# Altium schematic sheet Overview.SchDoc: Overview
size Letter; Date: 2017-02-04; DocumentNumber: 1; Revision: A; SheetNumber: 1; SheetTotal: 16; DesignedBy: Craig Comberbach
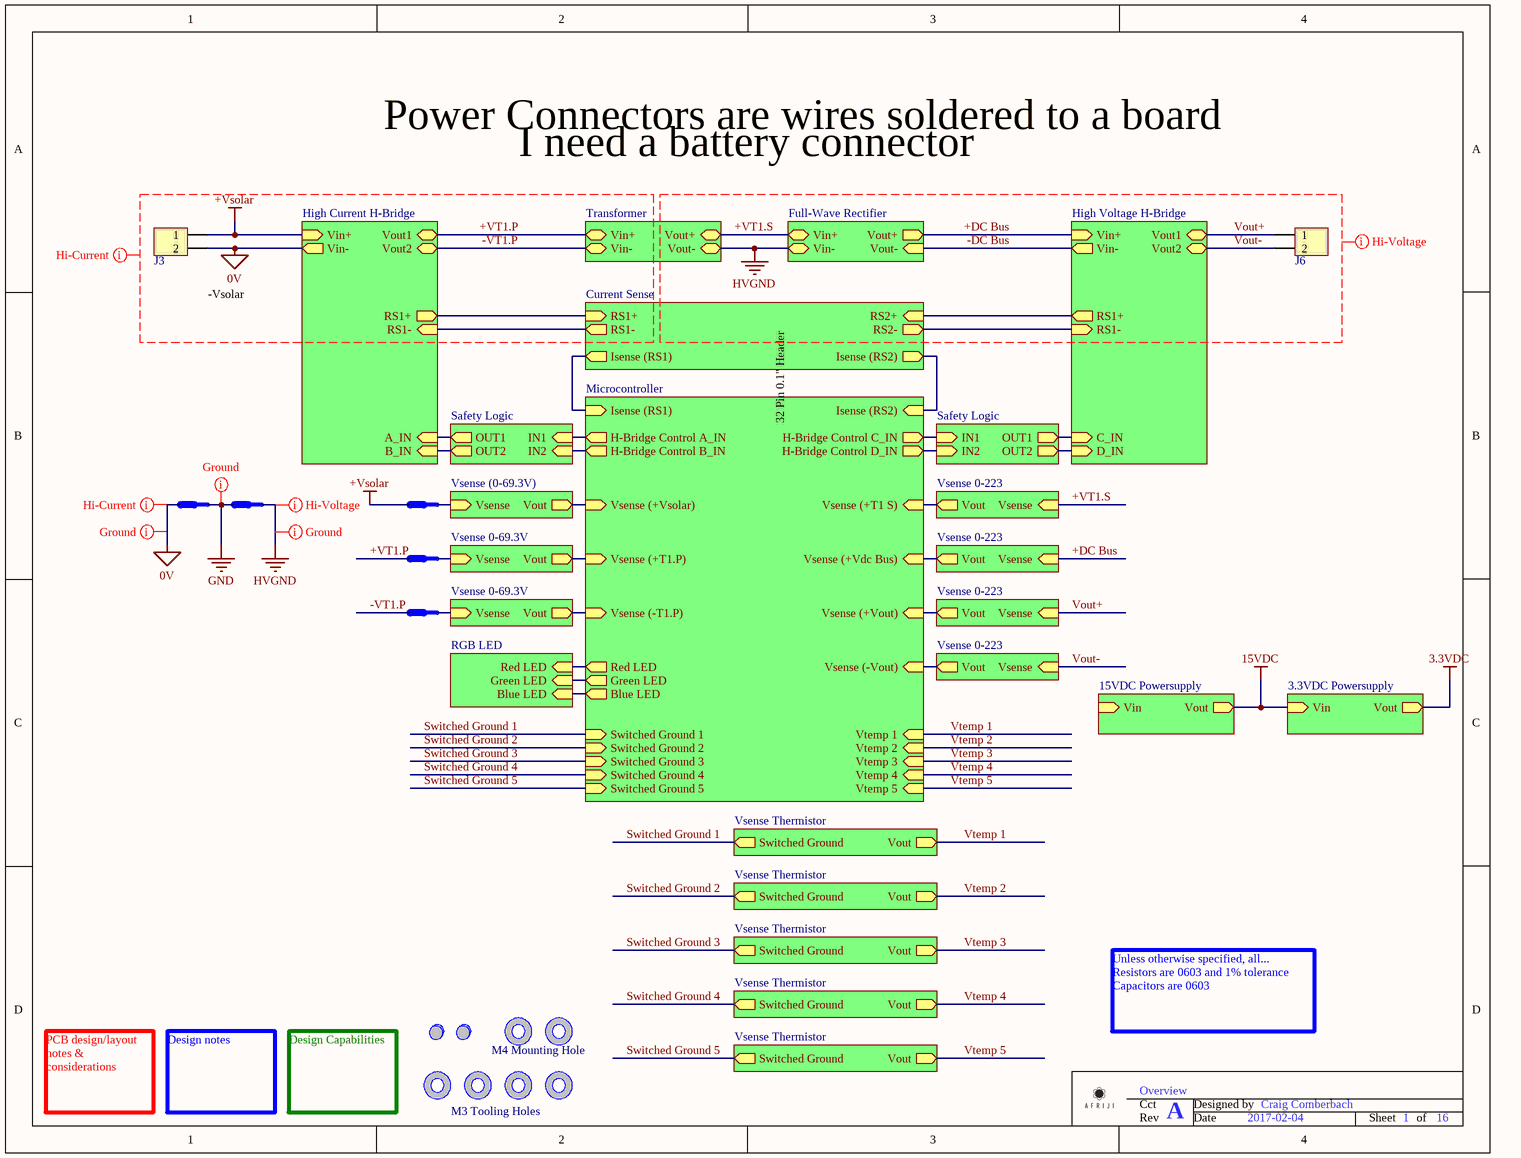
[diagram p0: Overview.SchDoc]

## Parts
FD1  Fiducial, Double Sided  [Fiducial - Double sided]  (value not drawn)
FD2  Fiducial, Double Sided  [Fiducial - Double sided]  (value not drawn)
J3  Terminal Block - 2-Position HiV/HiA  [TE 796739-2]  (value not drawn)
J6  Terminal Block - 2-Position HiV/HiA  [TE 796739-2]  (value not drawn)
MountingHole1  M3 Tooling Holes  [M3 Screw - One Sided]  (no BOM)
MountingHole2  Mounting Hole  [M3 Screw - One Sided]  (value not drawn)  (no BOM)
MountingHole3  Mounting Hole  [M4 Screw - One Sided]  (value not drawn)  (no BOM)
MountingHole4  M4 Mounting Hole  [M4 Screw - One Sided]  (no BOM)
MountingHole5  Mounting Hole  [M3 Screw - One Sided]  (value not drawn)  (no BOM)
MountingHole6  Mounting Hole  [M3 Screw - One Sided]  (value not drawn)  (no BOM)
NetTie2  Net Tie  [Net tie (7/50 mil)]  (value not drawn)  (net tie, no BOM)
NetTie3  Net Tie  [Net tie (7/7 mil)]  (value not drawn)  (net tie, no BOM)
NetTie7  Net Tie  [Net tie (7/7 mil)]  (value not drawn)  (net tie, no BOM)
NetTie8  Net Tie  [Net tie (7/7 mil)]  (value not drawn)  (net tie, no BOM)
NetTie9  Net Tie  [Net tie (7/7 mil)]  (value not drawn)  (net tie, no BOM)

## Sub-sheets
3.3VDC Powersupply = 3.3VDC Powersupply.SchDoc: Vin (in), Vout (out)
15VDC Powersupply = 15VDC Powersupply.SchDoc: Vin (in), Vout (out)
Current Sense = Current Sense.SchDoc: RS1+ (in), RS1- (out), RS2+ (in), RS2- (out), Isense (RS1) (out), Isense (RS2) (out)
Full-Wave Rectifier = Full-Wave Rectifier.SchDoc: Vin+ (bidir), Vin- (bidir), Vout+ (out), Vout- (in)
High Current H-Bridge = High Current H-Bridge.SchDoc: Vout1 (bidir), Vout2 (bidir), Vin+ (in), Vin- (out), A_IN (in), B_IN (in), RS1+ (out), RS1- (in)
High Voltage H-Bridge = High Voltage H-Bridge.SchDoc: Vout1 (bidir), Vout2 (bidir), Vin+ (in), Vin- (out), C_IN (in), D_IN (in), RS1+ (out), RS1- (in)
Microcontroller = Microcontroller.SchDoc: H-Bridge Control A_IN (out), H-Bridge Control B_IN (out), H-Bridge Control C_IN (out), H-Bridge Control D_IN (out), Red LED (out), Green LED (out), Blue LED (out), Vsense (+T1.P) (in), Vsense (+Vsolar) (in), Vsense (-T1.P) (in), Vsense (+T1 S) (in), Vsense (+Vdc Bus) (in), Vsense (+Vout) (in), Vsense (-Vout) (in), Vtemp 1 (in), Vtemp 2 (in), Vtemp 3 (in), Vtemp 4 (in), Vtemp 5 (in), Isense (RS1) (in), Isense (RS2) (in), Switched Ground 1 (in), Switched Ground 2 (in), Switched Ground 3 (in), Switched Ground 4 (in), Switched Ground 5 (in)
RGB LED = RGB LED.SchDoc: Red LED (in), Green LED (in), Blue LED (in)
Safety Logic = Safety Logic.SchDoc: IN1 (in), IN2 (in), OUT1 (out), OUT2 (out)
Safety Logic = Safety Logic.SchDoc: IN1 (in), IN2 (in), OUT1 (out), OUT2 (out)
Transformer = Transformer.SchDoc: Vin+ (bidir), Vin- (bidir), Vout+ (bidir), Vout- (bidir)
Vsense 0-69.3V = Vsense 0-69.3V.SchDoc: Vsense (in), Vout (out)
Vsense 0-69.3V = Vsense 0-69.3V.SchDoc: Vsense (in), Vout (out)
Vsense 0-223 = Vsense 0-223.3V.SchDoc: Vsense (in), Vout (out)
Vsense 0-223 = Vsense 0-223.3V.SchDoc: Vsense (in), Vout (out)
Vsense 0-223 = Vsense 0-223.3V.SchDoc: Vsense (in), Vout (out)
Vsense 0-223 = Vsense 0-223.3V.SchDoc: Vsense (in), Vout (out)
Vsense (0-69.3V) = Vsense 0-69.3V.SchDoc: Vsense (in), Vout (out)
Vsense Thermistor = Vsense Thermistor.SchDoc: Switched Ground (out), Vout (out)
Vsense Thermistor = Vsense Thermistor.SchDoc: Switched Ground (out), Vout (out)
Vsense Thermistor = Vsense Thermistor.SchDoc: Switched Ground (out), Vout (out)
Vsense Thermistor = Vsense Thermistor.SchDoc: Switched Ground (out), Vout (out)
Vsense Thermistor = Vsense Thermistor.SchDoc: Switched Ground (out), Vout (out)

## Nets
0V: J3.2 NetTie2.2 ; sheet High Current H-Bridge/Vin-
3.3VDC: sheet 3.3VDC Powersupply/Vout
15VDC: sheet 3.3VDC Powersupply/Vin, sheet 15VDC Powersupply/Vout
+Vsolar: J3.1 NetTie7.2 ; sheet High Current H-Bridge/Vin+
GND: NetTie2.1 NetTie3.2
HVGND: NetTie3.1 ; sheet Full-Wave Rectifier/Vin-, sheet Transformer/Vout-
+DC Bus: sheet Full-Wave Rectifier/Vout+, sheet High Voltage H-Bridge/Vin+, sheet Vsense 0-223/Vsense
+VT1.P: NetTie8.2 ; sheet High Current H-Bridge/Vout1, sheet Transformer/Vin+
+VT1.S: sheet Full-Wave Rectifier/Vin+, sheet Transformer/Vout+, sheet Vsense 0-223/Vsense
-DC Bus: sheet Full-Wave Rectifier/Vout-, sheet High Voltage H-Bridge/Vin-
-VT1.P: NetTie9.2 ; sheet High Current H-Bridge/Vout2, sheet Transformer/Vin-
Switched Ground 1: sheet Microcontroller/Switched Ground 1, sheet Vsense Thermistor/Switched Ground
Switched Ground 2: sheet Microcontroller/Switched Ground 2, sheet Vsense Thermistor/Switched Ground
Switched Ground 3: sheet Microcontroller/Switched Ground 3, sheet Vsense Thermistor/Switched Ground
Switched Ground 4: sheet Microcontroller/Switched Ground 4, sheet Vsense Thermistor/Switched Ground
Switched Ground 5: sheet Microcontroller/Switched Ground 5, sheet Vsense Thermistor/Switched Ground
Vout+: J6.1 ; sheet High Voltage H-Bridge/Vout1, sheet Vsense 0-223/Vsense
Vout-: J6.2 ; sheet High Voltage H-Bridge/Vout2, sheet Vsense 0-223/Vsense
Vtemp 1: sheet Microcontroller/Vtemp 1, sheet Vsense Thermistor/Vout
Vtemp 2: sheet Microcontroller/Vtemp 2, sheet Vsense Thermistor/Vout
Vtemp 3: sheet Microcontroller/Vtemp 3, sheet Vsense Thermistor/Vout
Vtemp 4: sheet Microcontroller/Vtemp 4, sheet Vsense Thermistor/Vout
Vtemp 5: sheet Microcontroller/Vtemp 5, sheet Vsense Thermistor/Vout
NetNetTie7_1: NetTie7.1 ; sheet Vsense (0-69.3V)/Vsense
NetNetTie8_1: NetTie8.1 ; sheet Vsense 0-69.3V/Vsense
NetNetTie9_1: NetTie9.1 ; sheet Vsense 0-69.3V/Vsense
(unnamed): sheet High Current H-Bridge/A_IN, sheet Safety Logic/OUT1
(unnamed): sheet High Current H-Bridge/B_IN, sheet Safety Logic/OUT2
(unnamed): sheet High Current H-Bridge/RS1+, sheet Current Sense/RS1+
(unnamed): sheet High Current H-Bridge/RS1-, sheet Current Sense/RS1-
(unnamed): sheet High Voltage H-Bridge/C_IN, sheet Safety Logic/OUT1
(unnamed): sheet High Voltage H-Bridge/D_IN, sheet Safety Logic/OUT2
(unnamed): sheet High Voltage H-Bridge/RS1+, sheet Current Sense/RS2+
(unnamed): sheet High Voltage H-Bridge/RS1-, sheet Current Sense/RS2-
(unnamed): sheet Microcontroller/H-Bridge Control A_IN, sheet Safety Logic/IN1
(unnamed): sheet Microcontroller/H-Bridge Control B_IN, sheet Safety Logic/IN2
(unnamed): sheet Microcontroller/H-Bridge Control C_IN, sheet Safety Logic/IN1
(unnamed): sheet Microcontroller/H-Bridge Control D_IN, sheet Safety Logic/IN2
(unnamed): sheet Microcontroller/Red LED, sheet RGB LED/Red LED
(unnamed): sheet Microcontroller/Green LED, sheet RGB LED/Green LED
(unnamed): sheet Microcontroller/Blue LED, sheet RGB LED/Blue LED
(unnamed): sheet Microcontroller/Vsense (+T1.P), sheet Vsense 0-69.3V/Vout
(unnamed): sheet Microcontroller/Vsense (+Vsolar), sheet Vsense (0-69.3V)/Vout
(unnamed): sheet Microcontroller/Vsense (-T1.P), sheet Vsense 0-69.3V/Vout
(unnamed): sheet Microcontroller/Vsense (+T1 S), sheet Vsense 0-223/Vout
(unnamed): sheet Microcontroller/Vsense (+Vdc Bus), sheet Vsense 0-223/Vout
(unnamed): sheet Microcontroller/Vsense (+Vout), sheet Vsense 0-223/Vout
(unnamed): sheet Microcontroller/Vsense (-Vout), sheet Vsense 0-223/Vout
(unnamed): sheet Microcontroller/Isense (RS1), sheet Current Sense/Isense (RS1)
(unnamed): sheet Microcontroller/Isense (RS2), sheet Current Sense/Isense (RS2)

## Layout directives
net class 15A: 0V, +Vsolar, +VT1.P, -VT1.P
net class 171-250V: +DC Bus, +VT1.S, -DC Bus, HVGND, Vout+, Vout-
net class Grounds: 0V, GND, HVGND

## Notes on the sheet
- Power Connectors are wires soldered to a board
- I need a battery connector
- (near J3) -Vsolar
- 32 Pin 0.1" Header
- Unless otherwise specified, all...
  Resistors are 0603 and 1% tolerance
  Capacitors are 0603
- PCB design/layout notes & considerations
- Design notes
- Design Capabilities
- Cct
- Designed by
- Rev
- Date
- Sheet
- of

## Library data of the parts
J3 J6 = Terminal Block - 2-Position HiV/HiA: Manufacturer: TE Connectivity AMP Connectors; Manufacturer Part Number: 796739-2; Number of Levels: 1; Positions Per Level: 2; Pitch: 0.375" (9.53mm); Mating Orientation: Horizontal with Board; Current: 30A; Voltage: 600V; Wire Gauge: 10-30 AWG; Wire Termination: Screw - Rising Cage Clamp; Clamp Material - Plating: Brass - Nickel Plated; Torque - Screw: 0.79 Nm (7.0 Lb-In); Screw Thread: M3; Supplier 1: Digi-Key; RoHS: RoHS Compliant; Category: Connectors, Interconnects; Stock 1: 14124; Pricing 1: 1=2.21, 10=1.673, 25=1.5504, 50=1.394, 100=1.36, 250=1.19, 500=1.088, 1000=0.986, 2500=0.884 (USD); Packaging: Tray; Part Status: Active; Mounting Type: Through Hole; Features: Interlocking (Side); Color: Green; Operating Temperature: -; Housing Material: Polyamide (PA66), Nylon 6/6; Contact Material - Plating: -; Screw Material - Plating: Brass - Nickel Plated; ComponentLink1URL: http://www.te.com/commerce/DocumentDelivery/DDEController?Action=srchrtrv&DocNm=796739&DocType=Customer+Drawing&DocLang=English; ComponentLink1Description: Spec Sheet; Supplier Part Number 1: A98273-ND
MountingHole1 MountingHole4 = Mounting Hole
NetTie2 NetTie3 NetTie7-NetTie9 = Net Tie: Ties two nets together
FD1 FD2 = Fiducial, Double Sided: Technology: Mechanical